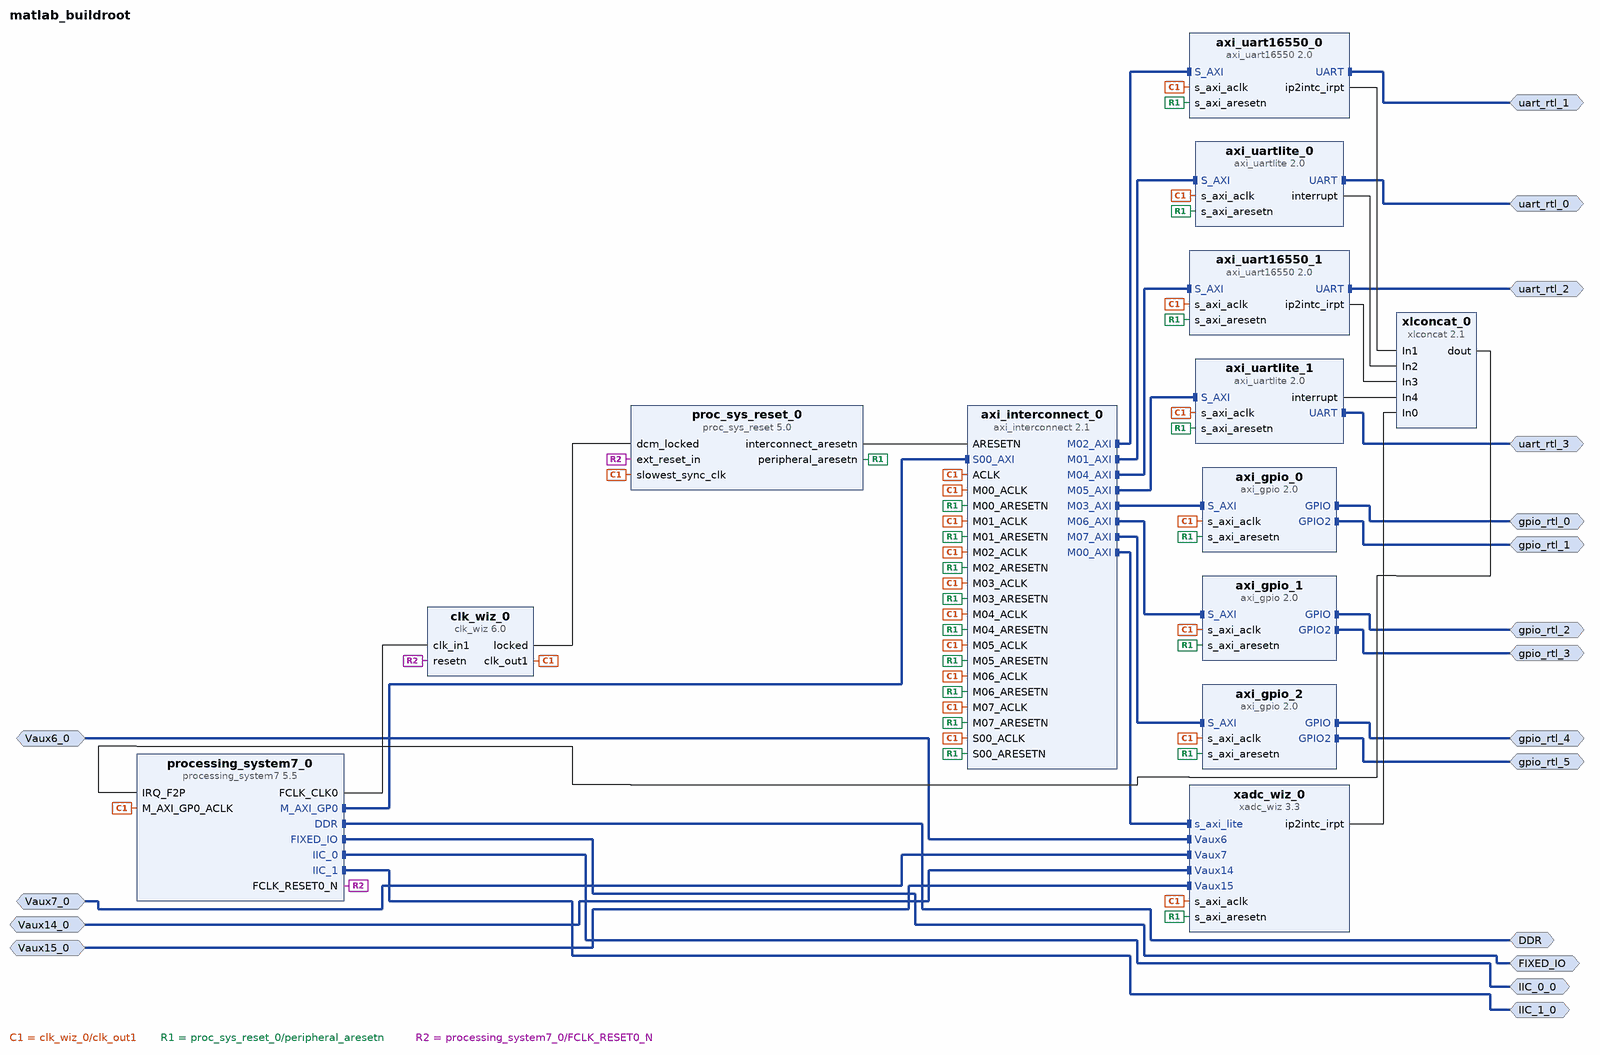
[diagram p0: block diagram of the top level]
# Vivado block design matlab_buildroot, xc7z020clg400-1, Vivado 2018.2
create_bd_design matlab_buildroot

create_bd_intf_port -mode Master -vlnv xilinx.com:interface:ddrx_rtl:1.0 DDR
create_bd_intf_port -mode Master -vlnv xilinx.com:display_processing_system7:fixedio_rtl:1.0 FIXED_IO
create_bd_intf_port -mode Slave -vlnv xilinx.com:interface:diff_analog_io_rtl:1.0 Vaux6_0
create_bd_intf_port -mode Slave -vlnv xilinx.com:interface:diff_analog_io_rtl:1.0 Vaux7_0
create_bd_intf_port -mode Slave -vlnv xilinx.com:interface:diff_analog_io_rtl:1.0 Vaux14_0
create_bd_intf_port -mode Slave -vlnv xilinx.com:interface:diff_analog_io_rtl:1.0 Vaux15_0
create_bd_intf_port -mode Master -vlnv xilinx.com:interface:uart_rtl:1.0 uart_rtl_0
create_bd_intf_port -mode Master -vlnv xilinx.com:interface:uart_rtl:1.0 uart_rtl_1
create_bd_intf_port -mode Master -vlnv xilinx.com:interface:iic_rtl:1.0 IIC_0_0
create_bd_intf_port -mode Master -vlnv xilinx.com:interface:iic_rtl:1.0 IIC_1_0
create_bd_intf_port -mode Master -vlnv xilinx.com:interface:gpio_rtl:1.0 gpio_rtl_0
create_bd_intf_port -mode Master -vlnv xilinx.com:interface:gpio_rtl:1.0 gpio_rtl_1
create_bd_intf_port -mode Master -vlnv xilinx.com:interface:uart_rtl:1.0 uart_rtl_2
create_bd_intf_port -mode Master -vlnv xilinx.com:interface:uart_rtl:1.0 uart_rtl_3
create_bd_intf_port -mode Master -vlnv xilinx.com:interface:gpio_rtl:1.0 gpio_rtl_2
create_bd_intf_port -mode Master -vlnv xilinx.com:interface:gpio_rtl:1.0 gpio_rtl_3
create_bd_intf_port -mode Master -vlnv xilinx.com:interface:gpio_rtl:1.0 gpio_rtl_4
create_bd_intf_port -mode Master -vlnv xilinx.com:interface:gpio_rtl:1.0 gpio_rtl_5

create_bd_cell -type ip -vlnv xilinx.com:ip:axi_interconnect:2.1 axi_interconnect_0
set_property -dict {CONFIG.NUM_MI 8} [get_bd_cells axi_interconnect_0]
create_bd_cell -type ip -vlnv xilinx.com:ip:clk_wiz:6.0 clk_wiz_0
set_property -dict {CONFIG.RESET_PORT resetn CONFIG.RESET_TYPE ACTIVE_LOW} [get_bd_cells clk_wiz_0]
create_bd_cell -type ip -vlnv xilinx.com:ip:proc_sys_reset:5.0 proc_sys_reset_0
create_bd_cell -type ip -vlnv xilinx.com:ip:processing_system7:5.5 processing_system7_0
set_property -dict [list \
  CONFIG.PCW_UIPARAM_DDR_FREQ_MHZ 533.333333 \
  CONFIG.PCW_APU_PERIPHERAL_FREQMHZ 667 \
  CONFIG.PCW_SDIO_PERIPHERAL_FREQMHZ 50 \
  CONFIG.PCW_UART_PERIPHERAL_FREQMHZ 100 \
  CONFIG.PCW_I2C_PERIPHERAL_FREQMHZ 111.111115 \
  CONFIG.PCW_FPGA0_PERIPHERAL_FREQMHZ 100 \
  CONFIG.PCW_FPGA1_PERIPHERAL_FREQMHZ 50 \
  CONFIG.PCW_USE_FABRIC_INTERRUPT 1 \
  CONFIG.PCW_IRQ_F2P_INTR 1 \
  CONFIG.PCW_PERIPHERAL_BOARD_PRESET None \
  CONFIG.PCW_PRESET_BANK1_VOLTAGE {LVCMOS 1.8V} \
  CONFIG.PCW_UIPARAM_DDR_MEMORY_TYPE {DDR 3 (Low Voltage)} \
  CONFIG.PCW_UIPARAM_DDR_PARTNO {MT41K256M16 RE-125} \
  CONFIG.PCW_QSPI_PERIPHERAL_ENABLE 1 \
  CONFIG.PCW_QSPI_QSPI_IO {MIO 1 .. 6} \
  CONFIG.PCW_QSPI_GRP_SINGLE_SS_ENABLE 1 \
  CONFIG.PCW_QSPI_GRP_SINGLE_SS_IO {MIO 1 .. 6} \
  CONFIG.PCW_SINGLE_QSPI_DATA_MODE x4 \
  CONFIG.PCW_QSPI_GRP_FBCLK_ENABLE 1 \
  CONFIG.PCW_QSPI_GRP_FBCLK_IO {MIO 8} \
  CONFIG.PCW_ENET0_PERIPHERAL_ENABLE 1 \
  CONFIG.PCW_ENET0_ENET0_IO {MIO 16 .. 27} \
  CONFIG.PCW_ENET0_GRP_MDIO_ENABLE 1 \
  CONFIG.PCW_ENET0_GRP_MDIO_IO {MIO 52 .. 53} \
  CONFIG.PCW_ENET_RESET_ENABLE 1 \
  CONFIG.PCW_ENET_RESET_SELECT {Share reset pin} \
  CONFIG.PCW_ENET0_RESET_ENABLE 0 \
  CONFIG.PCW_SD0_PERIPHERAL_ENABLE 1 \
  CONFIG.PCW_SD0_SD0_IO {MIO 40 .. 45} \
  CONFIG.PCW_SD0_GRP_CD_ENABLE 1 \
  CONFIG.PCW_SD0_GRP_CD_IO {MIO 47} \
  CONFIG.PCW_SD0_GRP_WP_ENABLE 0 \
  CONFIG.PCW_UART1_PERIPHERAL_ENABLE 1 \
  CONFIG.PCW_UART1_UART1_IO {MIO 48 .. 49} \
  CONFIG.PCW_SPI1_PERIPHERAL_ENABLE 1 \
  CONFIG.PCW_SPI1_SPI1_IO {MIO 10 .. 15} \
  CONFIG.PCW_SPI1_GRP_SS1_ENABLE 1 \
  CONFIG.PCW_SPI1_GRP_SS2_ENABLE 1 \
  CONFIG.PCW_TTC0_PERIPHERAL_ENABLE 1 \
  CONFIG.PCW_TTC0_TTC0_IO EMIO \
  CONFIG.PCW_USB0_PERIPHERAL_ENABLE 1 \
  CONFIG.PCW_USB0_USB0_IO {MIO 28 .. 39} \
  CONFIG.PCW_USB_RESET_ENABLE 1 \
  CONFIG.PCW_USB_RESET_SELECT {Share reset pin} \
  CONFIG.PCW_USB0_RESET_ENABLE 1 \
  CONFIG.PCW_USB0_RESET_IO {MIO 46} \
  CONFIG.PCW_I2C0_PERIPHERAL_ENABLE 1 \
  CONFIG.PCW_I2C0_I2C0_IO EMIO \
  CONFIG.PCW_I2C1_PERIPHERAL_ENABLE 1 \
  CONFIG.PCW_I2C1_I2C1_IO EMIO \
  CONFIG.PCW_I2C_RESET_ENABLE 1 \
  CONFIG.PCW_I2C_RESET_SELECT {Share reset pin} \
  CONFIG.PCW_GPIO_MIO_GPIO_ENABLE 1 \
  CONFIG.PCW_GPIO_MIO_GPIO_IO MIO \
] [get_bd_cells processing_system7_0]
# 518 more settings of processing_system7_0 are not shown: defaults, MIO pin electricals, DDR timing, and values the tool derives
create_bd_cell -type ip -vlnv xilinx.com:ip:xadc_wiz:3.3 xadc_wiz_0
set_property -dict [list \
  CONFIG.XADC_STARUP_SELECTION channel_sequencer \
  CONFIG.SEQUENCER_MODE Continuous \
  CONFIG.OT_ALARM false \
  CONFIG.USER_TEMP_ALARM false \
  CONFIG.VCCINT_ALARM false \
  CONFIG.VCCAUX_ALARM false \
  CONFIG.ENABLE_VCCPINT_ALARM false \
  CONFIG.ENABLE_VCCPAUX_ALARM false \
  CONFIG.ENABLE_VCCDDRO_ALARM false \
  CONFIG.SINGLE_CHANNEL_SELECTION TEMPERATURE \
  CONFIG.SINGLE_CHANNEL_ENABLE_CALIBRATION true \
  CONFIG.EXTERNAL_MUX_CHANNEL VP_VN \
  CONFIG.CHANNEL_ENABLE_VP_VN true \
  CONFIG.CHANNEL_ENABLE_VAUXP6_VAUXN6 true \
  CONFIG.CHANNEL_ENABLE_VAUXP7_VAUXN7 true \
  CONFIG.CHANNEL_ENABLE_VAUXP14_VAUXN14 true \
  CONFIG.CHANNEL_ENABLE_VAUXP15_VAUXN15 true \
] [get_bd_cells xadc_wiz_0]
create_bd_cell -type ip -vlnv xilinx.com:ip:axi_uartlite:2.0 axi_uartlite_0
set_property -dict {CONFIG.C_BAUDRATE 115200} [get_bd_cells axi_uartlite_0]
create_bd_cell -type ip -vlnv xilinx.com:ip:axi_uart16550:2.0 axi_uart16550_0
create_bd_cell -type ip -vlnv xilinx.com:ip:xlconcat:2.1 xlconcat_0
set_property -dict {CONFIG.NUM_PORTS 5} [get_bd_cells xlconcat_0]
create_bd_cell -type ip -vlnv xilinx.com:ip:axi_gpio:2.0 axi_gpio_0
set_property -dict [list \
  CONFIG.C_GPIO_WIDTH 4 \
  CONFIG.C_GPIO2_WIDTH 4 \
  CONFIG.C_IS_DUAL 1 \
  CONFIG.C_ALL_INPUTS 1 \
  CONFIG.C_ALL_INPUTS_2 1 \
] [get_bd_cells axi_gpio_0]
create_bd_cell -type ip -vlnv xilinx.com:ip:axi_uart16550:2.0 axi_uart16550_1
create_bd_cell -type ip -vlnv xilinx.com:ip:axi_uartlite:2.0 axi_uartlite_1
set_property -dict {CONFIG.C_BAUDRATE 115200} [get_bd_cells axi_uartlite_1]
create_bd_cell -type ip -vlnv xilinx.com:ip:axi_gpio:2.0 axi_gpio_1
set_property -dict [list \
  CONFIG.C_GPIO_WIDTH 4 \
  CONFIG.C_GPIO2_WIDTH 6 \
  CONFIG.C_IS_DUAL 1 \
  CONFIG.C_ALL_INPUTS 0 \
  CONFIG.C_DOUT_DEFAULT_2 0x00000000 \
  CONFIG.C_DOUT_DEFAULT 0x00000000 \
  CONFIG.C_ALL_INPUTS_2 0 \
  CONFIG.C_ALL_OUTPUTS 1 \
  CONFIG.C_ALL_OUTPUTS_2 1 \
] [get_bd_cells axi_gpio_1]
create_bd_cell -type ip -vlnv xilinx.com:ip:axi_gpio:2.0 axi_gpio_2
set_property -dict {CONFIG.C_GPIO_WIDTH 8 CONFIG.C_GPIO2_WIDTH 8 CONFIG.C_IS_DUAL 1} [get_bd_cells axi_gpio_2]

# ---- connections ----

connect_bd_intf_net [get_bd_intf_pins axi_interconnect_0/S00_AXI] [get_bd_intf_pins processing_system7_0/M_AXI_GP0]
connect_bd_intf_net [get_bd_intf_pins axi_interconnect_0/M00_AXI] [get_bd_intf_pins xadc_wiz_0/s_axi_lite]
connect_bd_intf_net [get_bd_intf_pins axi_interconnect_0/M01_AXI] [get_bd_intf_pins axi_uartlite_0/S_AXI]
connect_bd_intf_net [get_bd_intf_pins axi_interconnect_0/M02_AXI] [get_bd_intf_pins axi_uart16550_0/S_AXI]
connect_bd_intf_net [get_bd_intf_pins axi_interconnect_0/M03_AXI] [get_bd_intf_pins axi_gpio_0/S_AXI]
connect_bd_intf_net [get_bd_intf_pins axi_interconnect_0/M04_AXI] [get_bd_intf_pins axi_uart16550_1/S_AXI]
connect_bd_intf_net [get_bd_intf_pins axi_interconnect_0/M05_AXI] [get_bd_intf_pins axi_uartlite_1/S_AXI]
connect_bd_intf_net [get_bd_intf_pins axi_interconnect_0/M06_AXI] [get_bd_intf_pins axi_gpio_1/S_AXI]
connect_bd_intf_net [get_bd_intf_pins axi_interconnect_0/M07_AXI] [get_bd_intf_pins axi_gpio_2/S_AXI]
connect_bd_intf_net [get_bd_intf_ports DDR] [get_bd_intf_pins processing_system7_0/DDR]
connect_bd_intf_net [get_bd_intf_ports FIXED_IO] [get_bd_intf_pins processing_system7_0/FIXED_IO]
connect_bd_intf_net -intf_net Vaux6_0_1 [get_bd_intf_ports Vaux6_0] [get_bd_intf_pins xadc_wiz_0/Vaux6]
connect_bd_intf_net -intf_net Vaux7_0_1 [get_bd_intf_ports Vaux7_0] [get_bd_intf_pins xadc_wiz_0/Vaux7]
connect_bd_intf_net -intf_net Vaux14_0_1 [get_bd_intf_ports Vaux14_0] [get_bd_intf_pins xadc_wiz_0/Vaux14]
connect_bd_intf_net -intf_net Vaux15_0_1 [get_bd_intf_ports Vaux15_0] [get_bd_intf_pins xadc_wiz_0/Vaux15]
connect_bd_intf_net [get_bd_intf_ports uart_rtl_0] [get_bd_intf_pins axi_uartlite_0/UART]
connect_bd_intf_net [get_bd_intf_ports uart_rtl_1] [get_bd_intf_pins axi_uart16550_0/UART]
connect_bd_intf_net [get_bd_intf_ports IIC_0_0] [get_bd_intf_pins processing_system7_0/IIC_0]
connect_bd_intf_net [get_bd_intf_ports IIC_1_0] [get_bd_intf_pins processing_system7_0/IIC_1]
connect_bd_intf_net [get_bd_intf_ports gpio_rtl_0] [get_bd_intf_pins axi_gpio_0/GPIO]
connect_bd_intf_net [get_bd_intf_ports gpio_rtl_1] [get_bd_intf_pins axi_gpio_0/GPIO2]
connect_bd_intf_net [get_bd_intf_ports uart_rtl_2] [get_bd_intf_pins axi_uart16550_1/UART]
connect_bd_intf_net [get_bd_intf_ports uart_rtl_3] [get_bd_intf_pins axi_uartlite_1/UART]
connect_bd_intf_net [get_bd_intf_ports gpio_rtl_2] [get_bd_intf_pins axi_gpio_1/GPIO]
connect_bd_intf_net [get_bd_intf_ports gpio_rtl_3] [get_bd_intf_pins axi_gpio_1/GPIO2]
connect_bd_intf_net [get_bd_intf_ports gpio_rtl_4] [get_bd_intf_pins axi_gpio_2/GPIO]
connect_bd_intf_net [get_bd_intf_ports gpio_rtl_5] [get_bd_intf_pins axi_gpio_2/GPIO2]
connect_bd_net [get_bd_pins clk_wiz_0/clk_out1] \
  [get_bd_pins proc_sys_reset_0/slowest_sync_clk] [get_bd_pins processing_system7_0/M_AXI_GP0_ACLK] \
  [get_bd_pins xadc_wiz_0/s_axi_aclk] [get_bd_pins axi_uartlite_0/s_axi_aclk] [get_bd_pins axi_uart16550_0/s_axi_aclk] \
  [get_bd_pins axi_gpio_0/s_axi_aclk] [get_bd_pins axi_uart16550_1/s_axi_aclk] [get_bd_pins axi_uartlite_1/s_axi_aclk] \
  [get_bd_pins axi_gpio_1/s_axi_aclk] [get_bd_pins axi_interconnect_0/ACLK] [get_bd_pins axi_interconnect_0/M00_ACLK] \
  [get_bd_pins axi_interconnect_0/S00_ACLK] [get_bd_pins axi_interconnect_0/M01_ACLK] \
  [get_bd_pins axi_interconnect_0/M02_ACLK] [get_bd_pins axi_interconnect_0/M03_ACLK] \
  [get_bd_pins axi_interconnect_0/M04_ACLK] [get_bd_pins axi_interconnect_0/M05_ACLK] \
  [get_bd_pins axi_interconnect_0/M06_ACLK] [get_bd_pins axi_gpio_2/s_axi_aclk] [get_bd_pins axi_interconnect_0/M07_ACLK]
connect_bd_net [get_bd_pins clk_wiz_0/locked] [get_bd_pins proc_sys_reset_0/dcm_locked]
connect_bd_net [get_bd_pins proc_sys_reset_0/interconnect_aresetn] [get_bd_pins axi_interconnect_0/ARESETN]
connect_bd_net [get_bd_pins proc_sys_reset_0/peripheral_aresetn] \
  [get_bd_pins xadc_wiz_0/s_axi_aresetn] [get_bd_pins axi_uartlite_0/s_axi_aresetn] \
  [get_bd_pins axi_uart16550_0/s_axi_aresetn] [get_bd_pins axi_gpio_0/s_axi_aresetn] \
  [get_bd_pins axi_uart16550_1/s_axi_aresetn] [get_bd_pins axi_uartlite_1/s_axi_aresetn] \
  [get_bd_pins axi_gpio_1/s_axi_aresetn] [get_bd_pins axi_interconnect_0/M00_ARESETN] \
  [get_bd_pins axi_interconnect_0/S00_ARESETN] [get_bd_pins axi_interconnect_0/M01_ARESETN] \
  [get_bd_pins axi_interconnect_0/M02_ARESETN] [get_bd_pins axi_interconnect_0/M03_ARESETN] \
  [get_bd_pins axi_interconnect_0/M04_ARESETN] [get_bd_pins axi_interconnect_0/M05_ARESETN] \
  [get_bd_pins axi_interconnect_0/M06_ARESETN] [get_bd_pins axi_gpio_2/s_axi_aresetn] \
  [get_bd_pins axi_interconnect_0/M07_ARESETN]
connect_bd_net [get_bd_pins processing_system7_0/FCLK_CLK0] [get_bd_pins clk_wiz_0/clk_in1]
connect_bd_net [get_bd_pins processing_system7_0/FCLK_RESET0_N] [get_bd_pins clk_wiz_0/resetn] [get_bd_pins proc_sys_reset_0/ext_reset_in]
connect_bd_net [get_bd_pins xlconcat_0/dout] [get_bd_pins processing_system7_0/IRQ_F2P]
connect_bd_net [get_bd_pins xadc_wiz_0/ip2intc_irpt] [get_bd_pins xlconcat_0/In0]
connect_bd_net [get_bd_pins axi_uart16550_0/ip2intc_irpt] [get_bd_pins xlconcat_0/In1]
connect_bd_net [get_bd_pins axi_uartlite_0/interrupt] [get_bd_pins xlconcat_0/In2]
connect_bd_net [get_bd_pins axi_uart16550_1/ip2intc_irpt] [get_bd_pins xlconcat_0/In3]
connect_bd_net [get_bd_pins axi_uartlite_1/interrupt] [get_bd_pins xlconcat_0/In4]

# ---- address map ----
assign_bd_address -offset 0x41200000 -range 64K -target_address_space [get_bd_addr_spaces processing_system7_0/Data] [get_bd_addr_segs axi_gpio_0/S_AXI/Reg]
assign_bd_address -offset 0x41210000 -range 64K -target_address_space [get_bd_addr_spaces processing_system7_0/Data] [get_bd_addr_segs axi_gpio_1/S_AXI/Reg]
assign_bd_address -offset 0x41220000 -range 64K -target_address_space [get_bd_addr_spaces processing_system7_0/Data] [get_bd_addr_segs axi_gpio_2/S_AXI/Reg]
assign_bd_address -offset 0x42C00000 -range 64K -target_address_space [get_bd_addr_spaces processing_system7_0/Data] [get_bd_addr_segs axi_uartlite_0/S_AXI/Reg]
assign_bd_address -offset 0x42C10000 -range 64K -target_address_space [get_bd_addr_spaces processing_system7_0/Data] [get_bd_addr_segs axi_uartlite_1/S_AXI/Reg]
assign_bd_address -offset 0x43C00000 -range 64K -target_address_space [get_bd_addr_spaces processing_system7_0/Data] [get_bd_addr_segs xadc_wiz_0/s_axi_lite/Reg]
assign_bd_address -offset 0x43C10000 -range 64K -target_address_space [get_bd_addr_spaces processing_system7_0/Data] [get_bd_addr_segs axi_uart16550_0/S_AXI/Reg]
assign_bd_address -offset 0x43C20000 -range 64K -target_address_space [get_bd_addr_spaces processing_system7_0/Data] [get_bd_addr_segs axi_uart16550_1/S_AXI/Reg]

validate_bd_design
save_bd_design
